# Altium project Zebra_Modem.PrjPCB
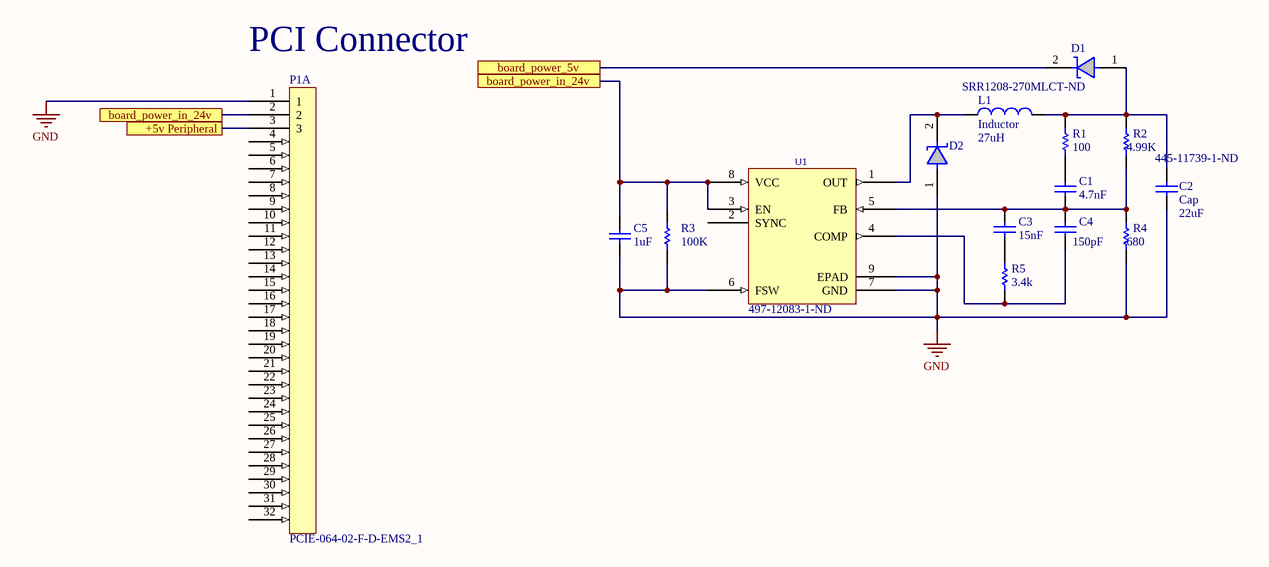
[diagram p0: BoardPower.SchDoc]
3 sheets, 25 parts. Net scope: flat (ports and power ports of the same name join across sheets).
Board file: PCB2.PcbDoc
Sheets:
  BoardPower.SchDoc
  Serial.SchDoc
  Master.SchDoc

## Sheet BoardPower.SchDoc
size A4; Organization: Altium Limited; Address1: L3, 12a Rodborough Rd; Address2: Frenchs Forest; Address3: NSW; Address4: Australia 2086

### Parts
C1  value 4.7nF  [0603]  (hidden comment: CAP_2)
C2  Cap  value 22uF  Supplier Part Number 1: 445-11739-1-ND  [C1206]
C3  value 15nF  [0603]  (hidden comment: CAP_1_17)
C4  value 150pF  [0402]  (hidden comment: CAP_1_16)
C5  value 1uF  [0402]  (hidden comment: CAP_1_21_3)
D1  SCHOTTKY DIODE  [SOT-23]  (value not drawn)
D2  SCHOTTKY DIODE  [SOT-23]  (value not drawn)
L1  Inductor  value 27uH  Supplier Part Number 1: SRR1208-270MLCT-ND  [IND_BOURNS_SRR12]
P1  PCIE-064-02-F-D-EMS2_1  [PCIE-064-02-F-D-EMS2]  (part A of 2)
R1  value 100  [0603]  (hidden comment: RES_9)
R2  value 4.99K  [0402]  (hidden comment: RES_38)
R3  value 100K  [0402]  (hidden comment: RES_11)
R4  value 680  [0402]  (hidden comment: RES_49)
R5  value 3.4k  [0603]  (hidden comment: RES_32)
U1  Supplier Part Number 1: 497-12083-1-ND  [L7986ATR]  (hidden comment: L7986ATR)

### Ports
+5v Peripheral, board_power_5v, board_power_in_24v

### Nets
GND: C2.1 C5.1 D2.1(A) P1.1 R3.2 R4.1 U1.6(FSW) U1.7(GND) U1.9(EPAD)
NetC1_1: C1.1 R1.1
NetC1_2: C1.2 C3.2 C4.2 R2.1 R4.2 U1.5(FB)
NetC2_2: C2.2 D1.1(A) L1.2 R1.2 R2.2
NetC3_1: C3.1 R5.2
NetC4_1: C4.1 R5.1 U1.4(COMP)
NetC5_2: C5.2 P1.2 R3.1 U1.3(EN) U1.8(VCC) ; port board_power_in_24v
NetD1_2: D1.2(K) ; port board_power_5v
NetD2_2: D2.2(K) L1.1 U1.1(OUT)
NetP1_3: P1.3 ; port +5v Peripheral

Not connected (* = marked no-connect by the designer): P1 4 5 6 7 8 9 10 11 12 13 14 15 16 17 18 19 20 21 22 23 24 25 26 27 28 29 30 31 32; U1 2(SYNC)

### Notes on the sheet
- (near P1) PCI Connector
- Title
- Size:
- Date:
- A4
- Number:
- Time:
- Revision:
- Sheet
- of
- File:

### Library data of the parts
C1 = CAP_2: 4.7nF 10% 50V; Manufacturer: Samsung; Manufacturer Part Number: CL10B472KB8NNNC; Material: Ceramic; Dielectric: C0G; Tolerance: 10%; Voltage: 50V; Supplier 1: Digi-Key; Supplier Part Number 1: 1276-1098-1-ND; Stock 1: 40000; Pricing 1: 1=0.1, 10=0.036, 100=0.0162, 500=0.01156, 1000=0.00908 (USD); Mount: Surface Mount; Case/Package: 0603; Case Code (Metric): 1608; Case Code (Imperial): 0603; Contact Plating: Tin; Min Operating Temperature: -55°C; Max Operating Temperature: 125°C; Capacitance: 4.7nF; Voltage Rating (DC): 50V; Packaging: Tape and Reel; Voltage Rating: 50V; Length: 1.6mm; Height: 0.8mm; Depth: 0.8mm; Width: 0.031inch; Thickness: 0.035inch; Radiation Hardening: No; Lead Free: Lead Free; ComponentLink1URL: https://www.verical.com/server-webapp/html/getDatasheet?partID=359559; ComponentLink1Description: https://www.verical.com/server-webapp/html/getDatasheet?partID=359559; ComponentLink2URL: https://media.digikey.com/pdf/Data%20Sheets/Samsung%20PDFs/CL_Series_MLCC_ds.pdf; ComponentLink2Description: https://media.digikey.com/pdf/Data%20Sheets/Samsung%20PDFs/CL_Series_MLCC_ds.pdf; ComponentLink3URL: http://www1.futureelectronics.com/doc/SAMSUNG%20PASSIVE/CL05B104KQ5NNNC.pdf; ComponentLink3Description: http://www1.futureelectronics.com/doc/SAMSUNG%20PASSIVE/CL05B104KQ5NNNC.pdf; ComponentLink4URL: https://www.distrelec.biz/Web/Downloads/_e/ng/MLCC_CatalogDownload2013_ENG.pdf?mime=application%2Fpdf; ComponentLink4Description: https://www.distrelec.biz/Web/Downloads/_e/ng/MLCC_CatalogDownload2013_ENG.pdf?mime=application%2Fpdf; ComponentLink5URL: https://produktinfo.conrad.com/datenblaetter/450000-474999/457744-da-01-en-VS_KONDENSATOR_0603.pdf; ComponentLink5Description: https://produktinfo.conrad.com/datenblaetter/450000-474999/457744-da-01-en-VS_KONDENSATOR_0603.pdf
C2 = Cap: Capacitor; Manufacturer: TDK; Manufacturer Part Number: C3216JB1V226M160AC; Description: 22µF ±20% 35V JB Ceramic Capacitor -25°C ~ 85°C Surface Mount, MLCC 1206 (3216 Metric) 0.126" L x 0.063" W (3.20mm x 1.60mm); Dielectric Material: Ceramic; Tolerance: 20%; Voltage Rating: 35V; Published: 8-Jun-2000; LatestRevisionDate: 17-Jul-2002; LatestRevisionNote: Re-released for DXP Platform.; PackageReference: RAD-0.3; Publisher: Altium Limited; PackageDescription: Radial Cap, Thru-Hole; 2 Leads; 0.3 in Pin Spacing; Supplier 1: Digi-Key; RoHS: Yes; Stock 1: 587; Pricing 1: 1 = 1.20000, 10 = 0.94900, 100 = 0.71160, 500 = 0.53762, 1000 = 0.47438 (USD); Mount: Surface Mount; Case/Package: 1206; Case Code (Metric): 3216; Case Code (Imperial): 1206; Min Operating Temperature: -25°C; Max Operating Temperature: 85°C; Package Quantity: 2000; Packaging: Tape and Reel; Capacitance: 22uF; Termination: SMD/SMT; Composition: Ceramic; Voltage Rating (DC): 35V; Length: 0.126inch; Height: 1.6mm; Width: 0.063inch; Thickness: 0.069inch; Lead Free: Lead Free
C3 = CAP_1_17: 15nF 10% 50V; Manufacturer: KEMET; Manufacturer Part Number: C0603C123K1RACTU; Dielectric Material: Ceramic; Capacitance: 12nF; Voltage Rating: 100V; Dielectric: X7R; Tolerance: 10%; Voltage: 50V; Supplier 1: Digi-Key; Supplier Part Number 1: 399-3473-1-ND; Stock 1: 40000; Pricing 1: 1=0.39, 10=0.27, 100=0.1617, 500=0.1213, 1000=0.10243 (USD); Mount: Surface Mount; Case/Package: 0603; Case Code (Imperial): 0603; Case Code (Metric): 1608; Min Operating Temperature: -55°C; Max Operating Temperature: 125°C; Packaging: Tape and Reel; Voltage Rating (DC): 100V; Package Quantity: 1; Termination: SMD/SMT; Length: 1.6mm; Height: 0.8mm; Width: 0.8mm; Thickness: 0.034inch; Depth: 0.8mm
C4 = CAP_1_16: 150pF 5% 50V; Manufacturer: AVX Corporation; Manufacturer Part Number: 04025A151JAT2A; Temperature Coefficient: C0G, NP0; Notification: Current market demand for these product types have resulted in fluctuating and extending lead times. Lead times may differ.; Supplier 1: Digi-Key; Supplier Part Number 1: 478-1084-1-ND; RoHS: RoHS Compliant; Category: Capacitors; Stock 1: 55500; Pricing 1: 1=0.19, 10=0.133, 100=0.0625, 500=0.04384, 1000=0.0363, 2500=0.03378, 5000=0.03091 (USD); Packaging: Cut Tape (CT); Part Status: Active; Tolerance: ±5%; Voltage - Rated: 50V; Operating Temperature: -55°C ~ 125°C; Features: -; Ratings: -; Applications: General Purpose; Mounting Type: Surface Mount, MLCC; Package / Case: 0402 (1005 Metric); Size / Dimension: 0.039" L x 0.020" W (1.00mm x 0.50mm); Height - Seated (Max): -; Thickness (Max): 0.022" (0.56mm); Lead Spacing: -; Lead Style: -; ComponentLink1URL: http://datasheets.avx.com/C0GNP0-Dielectric.pdf; ComponentLink1Description: http://datasheets.avx.com/C0GNP0-Dielectric.pdf
C5 = CAP_1_21_3: 1uF 10% 50V; Manufacturer: Samsung Electro-Mechanics; Manufacturer Part Number: CL05A105KA5NQNC; Voltage - Rated: 25V; Temperature Coefficient: X5R; Notification: Current market demand for these product types have resulted in fluctuating and extending lead times. Lead times may differ.; Supplier 1: Digi-Key; Supplier Part Number 1: 1276-1445-1-ND; RoHS: RoHS Compliant; Category: Capacitors; Stock 1: 47496; Pricing 1: 1=0.33, 10=0.222, 100=0.1151, 500=0.08052, 1000=0.07188, 2500=0.069, 5000=0.06325 (USD); Packaging: Cut Tape (CT); Part Status: Active; Tolerance: ±10%; Operating Temperature: -55°C ~ 85°C; Features: -; Ratings: -; Applications: General Purpose; Mounting Type: Surface Mount, MLCC; Package / Case: 0402 (1005 Metric); Size / Dimension: 0.039" L x 0.020" W (1.00mm x 0.50mm); Height - Seated (Max): -; Thickness (Max): 0.022" (0.55mm); Lead Spacing: -; Lead Style: -; ComponentLink1URL: http://www.samsungsem.com/kr/support/product-search/mlcc/CL05A105KA5NQNC.jsp; ComponentLink1Description: http://www.samsungsem.com/kr/support/product-search/mlcc/CL05A105KA5NQNC.jsp
D1 D2 = SCHOTTKY DIODE: Manufacturer: Diodes; Manufacturer Part Number: BAT54-7-F; Forward Voltage: 800mV; Forward Current: 200mA; Peak Reverse Current: 2uA; Max Power Dissipation: 200mW; Reverse Recovery Time: 5ns; Max Repetitive Reverse Voltage (Vrrm): 30V; Max Forward Surge Current (Ifsm): 600mA; Element Configuration: Single; Polarity: Standard; Capacitance: 10pF; Max Surge Current: 75A; Max Reverse Leakage Current: 100uA; Supplier 1: Digi-Key; Supplier Part Number 1: BAT54-FDICT-ND; Stock 1: 396335; Pricing 1: 1=0.13, 10=0.117, 100=0.0634, 500=0.03904, 1000=0.02662 (GBP); Case/Package: SOT; Number of Pins: 3; Weight: 0.000282oz; Contact Plating: Matte,Tin; Min Operating Temperature: -65°C; Max Operating Temperature: 150°C; Packaging: Tape and Reel; Package Quantity: 3000; Average Rectified Current: 200mA; Peak Non-Repetitive Surge Current: 600mA; Power Dissipation: 200mW; Termination: SMD/SMT; Voltage Rating (DC): 30V; Power Rating: 200mW; Current Rating: 200mA; Output Current: 200mA; Max Reverse Voltage (DC): 30V; Length: 2.9mm; Height: 1mm; Width: 1.3mm; Radiation Hardening: No; Lead Free: Lead Free; ComponentLink1URL: http://www.jameco.com/Jameco/Products/ProdDS/1539180.pdf; ComponentLink1Description: http://www.jameco.com/Jameco/Products/ProdDS/1539180.pdf; ComponentLink2URL: https://www.verical.com/server-webapp/html/getDatasheet?partID=141352; ComponentLink2Description: https://www.verical.com/server-webapp/html/getDatasheet?partID=141352; Supplier 2: Digi-Key; Supplier Part Number 2: 497-4673-1-ND; Stock 2: 24; Pricing 2: 1=0.84, 10=0.742, 100=0.5689, 500=0.4497, 1000=0.35976 (USD); Mount: Surface Mount; REACH SVHC: No SVHC; ComponentLink3URL: http://www.st.com/web/en/resource/technical/document/datasheet/CD00002082.pdf; ComponentLink3Description: http://www.st.com/web/en/resource/technical/document/datasheet/CD00002082.pdf; ComponentLink4URL: http://www.st.com/content/ccc/resource/technical/document/datasheet/group1/48/52/98/4d/1d/c7/40/65/CD00002082/files/CD00002082.pdf/jcr:content/translations/en.CD00002082.pdf; ComponentLink4Description: http://www.st.com/content/ccc/resource/technical/document/datasheet/group1/48/52/98/4d/1d/c7/40/65/CD00002082/files/CD00002082.pdf/jcr:content/translations/en.CD00002082.pdf; ComponentLink5URL: http://www.st.com/st-web-ui/static/active/en/resource/technical/document/datasheet/CD00002082.pdf; ComponentLink5Description: http://www.st.com/st-web-ui/static/active/en/resource/technical/document/datasheet/CD00002082.pdf; ComponentLink6URL: http://datasheet.iiic.cc/stmicroelectronics/STPS3L40S.pdf; ComponentLink6Description: http://datasheet.iiic.cc/stmicroelectronics/STPS3L40S.pdf
L1 = Inductor: Manufacturer: Bourns; Manufacturer Part Number: SRR1208-270ML; Code_IEC: 1005; Description: FIXED IND 27UH 3A 48 MOHM SMD; Core Material: Ferrite; Material: Steel; Current Rating: 3A; Saturation Current: 4.3A; Tolerance: 20%; Shielding: Shielded; Q Factor: 23; Self Resonant Frequency: 6.5MHz; Resistance: 48MR; Test Frequency: 1kHz; Published: 8-Jun-2000; LatestRevisionDate: 29-May-2009; LatestRevisionNote: IPC-7351 Footprint Added.; PackageReference: 0402-A; Publisher: Altium Limited; PackageDescription: Chip Inductor; Code_JEITA: 0402; Supplier 1: Digi-Key; RoHS: Yes; Stock 1: 16310; Pricing 1: 1 = 1.13000, 10 = 1.04700, 100 = 0.75670 (USD); Mount: Surface Mount; Case/Package: Nonstandard; Min Operating Temperature: -40°C; Max Operating Temperature: 125°C; Package Quantity: 400; Packaging: Tape and Reel; Inductance Tolerance: 20%; Frequency: 6.5MHz; Composition: Wirewound; Inductance: 27uh; DC Resistance (DCR): 48mR; Max DC Current: 3A; Termination: SMD/SMT; DC Current: 3A; Military Standard: Not; RMS Current (Irms): 3A; Length: 12.7mm; Height: 8.5mm; Width: 12.7mm; Height - Seated (Max): 0.335inch; Depth: 13mm; Radiation Hardening: No; REACH SVHC: No SVHC; ComponentLink1URL: https://www.bourns.com/docs/Product-Datasheets/SRR1208.pdf; ComponentLink1Description: https://www.bourns.com/docs/Product-Datasheets/SRR1208.pdf; ComponentLink2URL: http://www.bourns.com/pdfs/srr1208.pdf; ComponentLink2Description: http://www.bourns.com/pdfs/srr1208.pdf; ComponentLink3URL: http://www.farnell.com/datasheets/1483756.pdf; ComponentLink3Description: http://www.farnell.com/datasheets/1483756.pdf; ComponentLink4URL: http://www.mouser.com/ds/2/54/rr1208-777886.pdf; ComponentLink4Description: http://www.mouser.com/ds/2/54/rr1208-777886.pdf; ComponentLink5URL: http://www.produktinfo.conrad.com/datenblaetter/1000000-1099999/001056595-da-01-en-MAG_ABGE_L_IND_SRR1208_270ML_27UH_20_.pdf; ComponentLink5Description: http://www.produktinfo.conrad.com/datenblaetter/1000000-1099999/001056595-da-01-en-MAG_ABGE_L_IND_SRR1208_270ML_27UH_20_.pdf
R1 = RES_9: RES 100 0.1W ±1% 0603 (1608); Manufacturer: Panasonic Electronic Components; Manufacturer Part Number: ERA-3AEB101V; Tolerance: ±0.1%; Power (Watts): 0.1W, 1/10W; Temperature Coefficient: ±25ppm/°C; Supplier 1: Digi-Key; Supplier Part Number 1: P100DBCT-ND; RoHS: RoHS Compliant; Category: Resistors; Stock 1: 413728; Pricing 1: 1=0.35, 10=0.3, 100=0.1172, 1000=0.04906, 2500=0.04498 (USD); Packaging: Cut Tape (CT); Part Status: Active; Composition: Thin Film; Features: Automotive AEC-Q200; Operating Temperature: -55°C ~ 155°C; Package / Case: 0603 (1608 Metric); Supplier Device Package: 0603; Size / Dimension: 0.063" L x 0.031" W (1.60mm x 0.80mm); Height - Seated (Max): 0.022" (0.55mm); Failure Rate: -; ComponentLink1URL: https://industrial.panasonic.com/cdbs/www-data/pdf/RDM0000/AOA0000C307.pdf; ComponentLink1Description: https://industrial.panasonic.com/cdbs/www-data/pdf/RDM0000/AOA0000C307.pdf
R2 = RES_38: RES 4.99K ±1% 0603 (1608); Manufacturer: Panasonic Electronic Components; Manufacturer Part Number: ERA-2AEB4991X; Tolerance: ±0.1%; Power (Watts): 0.063W, 1/16W; Temperature Coefficient: ±25ppm/°C; Supplier 1: Digi-Key; Supplier Part Number 1: P4.99KDCCT-ND; RoHS: RoHS Compliant; Category: Resistors; Stock 1: 434290; Pricing 1: 1=0.45, 10=0.321, 100=0.1283, 1000=0.06322, 2500=0.05858, 5000=0.053 (USD); Packaging: Cut Tape (CT); Part Status: Active; Composition: Thin Film; Features: Automotive AEC-Q200; Operating Temperature: -55°C ~ 155°C; Package / Case: 0402 (1005 Metric); Supplier Device Package: 0402; Size / Dimension: 0.039" L x 0.020" W (1.00mm x 0.50mm); Height - Seated (Max): 0.016" (0.40mm); Failure Rate: -; ComponentLink1URL: https://industrial.panasonic.com/cdbs/www-data/pdf/RDM0000/AOA0000C307.pdf; ComponentLink1Description: https://industrial.panasonic.com/cdbs/www-data/pdf/RDM0000/AOA0000C307.pdf
R3 = RES_11: RES 100K 0.1W ±1% 0603 (1608 Metric); Manufacturer: Vishay Dale; Manufacturer Part Number: TNPW0402100KBEED; Tolerance: ±0.1%; Power (Watts): 0.1W, 1/10W; Temperature Coefficient: ±25ppm/°C; Supplier 1: Digi-Key; Supplier Part Number 1: TNP100KDACT-ND; RoHS: RoHS Compliant; Category: Resistors; Stock 1: 177054; Pricing 1: 1=0.65, 10=0.462, 100=0.2402, 1000=0.12936, 2500=0.1276 (USD); Packaging: Cut Tape (CT); Part Status: Active; Composition: Thin Film; Features: Anti-Sulfur, Automotive AEC-Q200, Moisture Resistant; Operating Temperature: -55°C ~ 155°C; Package / Case: 0402 (1005 Metric); Supplier Device Package: 0402; Size / Dimension: 0.039" L x 0.020" W (1.00mm x 0.50mm); Height - Seated (Max): 0.016" (0.40mm); Failure Rate: -; ComponentLink1URL: http://www.vishay.com/docs/28758/tnpw_e3.pdf; ComponentLink1Description: http://www.vishay.com/docs/28758/tnpw_e3.pdf
R4 = RES_49: RES 680 ±1% 0603 (1608); Manufacturer: Panasonic Electronic Components; Manufacturer Part Number: ERA-2AED681X; Tolerance: ±0.5%; Power (Watts): 0.063W, 1/16W; Temperature Coefficient: ±25ppm/°C; Supplier 1: Digi-Key; Supplier Part Number 1: P680DECT-ND; RoHS: RoHS Compliant; Category: Resistors; Stock 1: 23860; Pricing 1: 1=0.22, 10=0.188, 100=0.0735, 1000=0.03077, 2500=0.0282, 5000=0.02564 (USD); Packaging: Cut Tape (CT); Part Status: Active; Composition: Thin Film; Features: Automotive AEC-Q200; Operating Temperature: -55°C ~ 155°C; Package / Case: 0402 (1005 Metric); Supplier Device Package: 0402; Size / Dimension: 0.039" L x 0.020" W (1.00mm x 0.50mm); Height - Seated (Max): 0.016" (0.40mm); Failure Rate: -; ComponentLink1URL: https://industrial.panasonic.com/cdbs/www-data/pdf/RDM0000/AOA0000C307.pdf; ComponentLink1Description: https://industrial.panasonic.com/cdbs/www-data/pdf/RDM0000/AOA0000C307.pdf
R5 = RES_32: RES 3.4K ±1% 0603 (1608); Manufacturer: Panasonic; Manufacturer Part Number: ERA3AEB3401V; Power Rating: 100mW; Resistance: 3.4kR; Voltage Rating: 75V; Temperature Coefficient: 25ppm/°C; Power: *; Tolerance: *; Supplier 1: Digi-Key; Supplier Part Number 1: P3.4KDBCT-ND; Stock 1: 33449; Pricing 1: 1=0.35, 10=0.3, 100=0.1172, 1000=0.04906, 2500=0.04498 (USD); Mount: Surface Mount; Case/Package: 0603; Number of Pins: 2; Case Code (Metric): 1608; Case Code (Imperial): 0603; Contact Plating: Tin; Min Operating Temperature: -55°C; Max Operating Temperature: 155°C; Packaging: Tape and Reel; Package Quantity: 1; Composition: Metal Film,Thin Film; Number of Terminations: 2; Military Standard: Not; Max Power Dissipation: 100mW; Voltage Rating (DC): 75V; Features: Automotive AEC-Q200; Length: 1.6mm; Height: 0.45mm; Width: 0.8mm; Depth: 0.8mm; Radiation Hardening: No; REACH SVHC: No SVHC; Lead Free: Lead Free; ComponentLink1URL: http://uk.rs-online.com/webdocs/0eb1/0900766b80eb1d8c.pdf; ComponentLink1Description: http://uk.rs-online.com/webdocs/0eb1/0900766b80eb1d8c.pdf; ComponentLink2URL: http://industrial.panasonic.com/www-data/pdf/AOA0000/AOA0000CE26.pdf; ComponentLink2Description: http://industrial.panasonic.com/www-data/pdf/AOA0000/AOA0000CE26.pdf; ComponentLink3URL: http://www.farnell.com/datasheets/485442.pdf; ComponentLink3Description: http://www.farnell.com/datasheets/485442.pdf
U1 = L7986ATR: IC Switching Regulator 3A STEP-DOWN 8-HSOP; Title: L7986TATR; Supplier 1: Digi-Key

## Sheet Serial.SchDoc
size A4; Organization: Altium Limited; Address1: L3, 12a Rodborough Rd; Address2: Frenchs Forest; Address3: NSW; Address4: Australia 2086
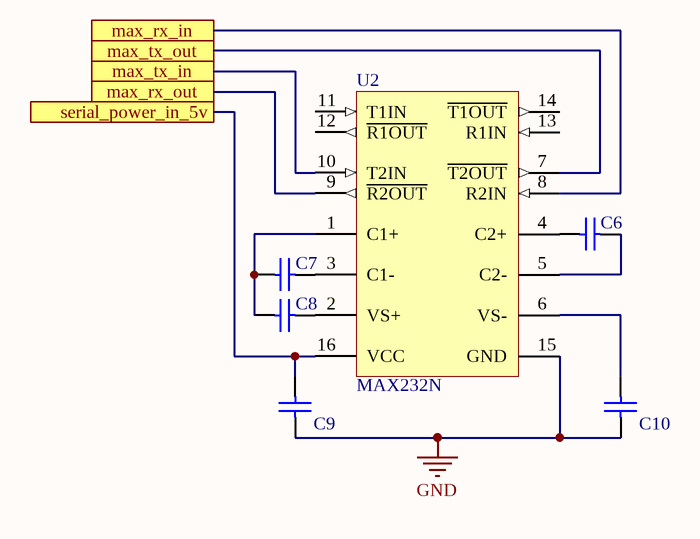
[diagram p1: Serial.SchDoc]

### Parts
C6  CAP_1_21_4  [0402]  (value not drawn)
C7  CAP_1_21_4  [0402]  (value not drawn)
C8  CAP_1_21_4  [0402]  (value not drawn)
C9  CAP_1_21_4  [0402]  (value not drawn)
C10  CAP_1_21_4  [0402]  (value not drawn)
U2  MAX232N  [N0016A]

### Ports
max_rx_in, max_rx_out, max_tx_in, max_tx_out, serial_power_in_5v

### Nets
GND: C9.1 C10.1 U2.15(GND)
NetC6_1: C6.1 U2.4(C2+)
NetC6_2: C6.2 U2.5(C2-)
NetC7_1: C7.1 C8.1 U2.1(C1+)
NetC7_2: C7.2 U2.3(C1-)
NetC8_2: C8.2 U2.2(VS+)
NetC9_2: C9.2 U2.16(VCC) ; port serial_power_in_5v
NetC10_2: C10.2 U2.6(VS-)
NetP4_7: U2.8(R2IN) ; port max_rx_in
NetP4_9: U2.7(~{T2OUT}) ; port max_tx_out
NetP4_11: U2.10(T2IN) ; port max_tx_in
NetP4_13: U2.9(~{R2OUT}) ; port max_rx_out

Not connected (* = marked no-connect by the designer): U2 11(T1IN) 12(~{R1OUT}) 13(R1IN) 14(~{T1OUT})

### Notes on the sheet
- Title
- Size:
- Date:
- A4
- Number:
- Time:
- Revision:
- Sheet
- of
- File:

### Library data of the parts
C6-C10 = CAP_1_21_4: 1uF 10% 10V; Manufacturer: Samsung; Manufacturer Part Number: CL05A105MP5NNNC; Dielectric: X5R; Tolerance: 10%; Value: 1uF; Voltage: 10V; Supplier 1: Digi-Key; Supplier Part Number 1: 1276-1448-1-ND; Stock 1: 100000; Pricing 1: 1=0.1, 10=0.031, 100=0.014, 500=0.01002, 1000=0.00787, 2500=0.00716, 5000=0.00658 (USD); Mount: Surface Mount; Case/Package: 0402; Case Code (Metric): 1005; Case Code (Imperial): 0402; Min Operating Temperature: -55°C; Max Operating Temperature: 85°C; Package Quantity: 1; Packaging: Tape and Reel; Capacitance: 1uF; Voltage Rating: 10V; Voltage Rating (DC): 10V; Length: 1mm; Height: 0.5mm; Width: 0.02inch; Thickness: 0.022inch; Depth: 0.5mm; Radiation Hardening: No; Lead Free: Lead Free; ComponentLink1URL: https://media.digikey.com/pdf/Data%20Sheets/Samsung%20PDFs/CL_Series_MLCC_ds.pdf; ComponentLink1Description: https://media.digikey.com/pdf/Data%20Sheets/Samsung%20PDFs/CL_Series_MLCC_ds.pdf
U2 = CMP-0299-00084-2: Dual EIA-232 Driver / Receiver, 0 to 70 degC, 16-Pin PDIP (N), Pb-Free (RoHS); Single Supply: TRUE; ICC(Max)(mA): 10; SubFamily: RS-232; Supply Voltage(s)(V): 5; ESD HBM(kV): +/-2; Receivers Per Package: 2; ComponentLink1Description: Manufacturer URL; PackageDescription: 16-Pin Plastic Dual-In-Line Package, Row Spacing 7.62 mm, Pitch 2.54 mm; ComponentLink3Description: Package Specification; DatasheetVersion: SLLS047L; ComponentLink2URL: http://www.ti.com/general/docs/lit/getliterature.tsp?genericPartNumber=MAX232&fileType=pdf; RS-232: TRUE; ComponentLink3URL: http://www.ti.com/litv/pdf/mpdi002c; PackageReference: N0016A; PackageVersion: revE, Dec-2002; ComponentLink1URL: www.ti.com; Drivers Per Package: 2; ComponentLink2Description: Datasheet

## Sheet Master.SchDoc
size A4; Organization: Altium Limited; Address1: L3, 12a Rodborough Rd; Address2: Frenchs Forest; Address3: NSW; Address4: Australia 2086
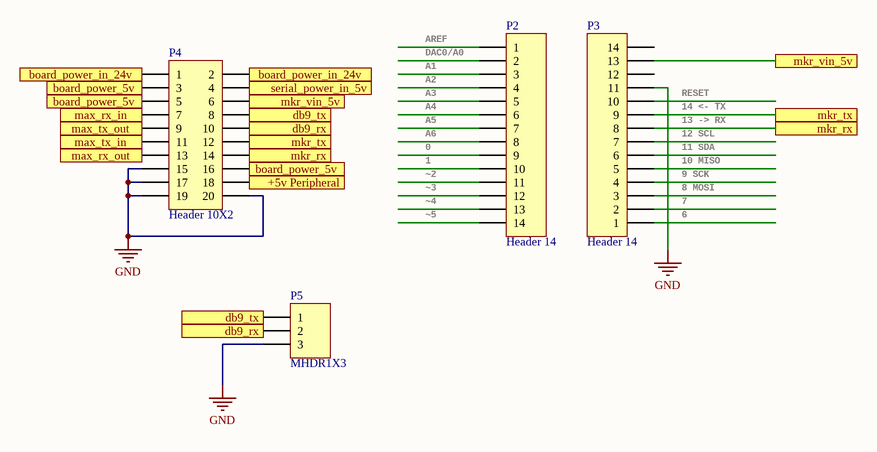
[diagram p2: Master.SchDoc]

### Parts
P2  Header 14  [HDR1X14]
P3  Header 14  [HDR1X14]
P4  Header 10X2  [HDR2X10]
P5  MHDR1X3  [MHDR1X3]

### Ports
+5v Peripheral, board_power_5v, board_power_in_24v, db9_rx, db9_tx, max_rx_in, max_rx_out, max_tx_in, max_tx_out, mkr_rx, mkr_tx, mkr_vin_5v, serial_power_in_5v

### Nets
GND: P3.11 P4.15 P4.17 P4.19 P4.20 P5.3
NetC5_2: P4.1 P4.2 ; port board_power_in_24v
NetC9_2: P4.4 ; port serial_power_in_5v
NetD1_2: P4.3 P4.5 P4.16 ; port board_power_5v
NetP1_3: P4.18 ; port +5v Peripheral
NetP3_8: P3.8 P4.14 ; port mkr_rx
NetP3_9: P3.9 P4.12 ; port mkr_tx
NetP3_13: P3.13 P4.6 ; port mkr_vin_5v
NetP4_7: P4.7 ; port max_rx_in
NetP4_8: P4.8 P5.1 ; port db9_tx
NetP4_9: P4.9 ; port max_tx_out
NetP4_10: P4.10 P5.2 ; port db9_rx
NetP4_11: P4.11 ; port max_tx_in
NetP4_13: P4.13 ; port max_rx_out

Not connected (* = marked no-connect by the designer): P2 1 2 3 4 5 6 7 8 9 10 11 12 13 14; P3 1 2 3 4 5 6 7 10 12 14

### Notes on the sheet
- AREF
- (near P2) DAC0/A0
- A1
- A2
- A3
- A4
- A5
- A6
- 14 <- TX
- 13 -> RX
- 12 SCL
- RESET
- 0
- 1
- ~2
- ~3
- ~4
- 11 SDA
- 7
- 8 MOSI
- 9 SCK
- 10 MISO
- ~5
- 6
- Title
- Size:
- Date:
- Number:
- Time:
- Revision:
- Sheet
- of
- File:

### Library data of the parts
P2 P3 = Header 14: Header, 14-Pin; LatestRevisionDate: 17-Jul-2002; LatestRevisionNote: Re-released for DXP Platform.; Publisher: Altium Limited
P4 = Header 10X2: Header, 10-Pin, Dual row; LatestRevisionDate: 17-Jul-2002; LatestRevisionNote: Re-released for DXP Platform.; Publisher: Altium Limited
P5 = MHDR1X3: Header, 3-Pin; LatestRevisionDate: 17-Jul-2002; LatestRevisionNote: Re-released for DXP Platform.; Publisher: Altium Limited

## Nets that join several sheets
GND: BoardPower (9 pins), Serial (C9.1 C10.1 U2.15), Master (6 pins)
NetC5_2: BoardPower (5 pins), Master (P4.1 P4.2)
NetC9_2: Serial (C9.2 U2.16), Master (P4.4)
NetD1_2: BoardPower (D1.2), Master (P4.3 P4.5 P4.16)
NetP1_3: BoardPower (P1.3), Master (P4.18)
NetP4_7: Serial (U2.8), Master (P4.7)
NetP4_9: Serial (U2.7), Master (P4.9)
NetP4_11: Serial (U2.10), Master (P4.11)
NetP4_13: Serial (U2.9), Master (P4.13)